# Altium schematic sheet Sheet1.SchDoc
size A4
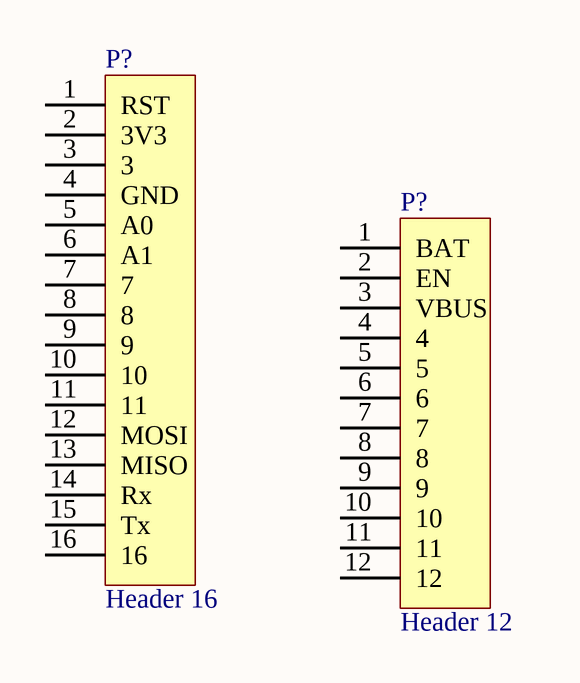
[diagram p0: Sheet1.SchDoc]

## Parts
(Parts that share a designator on the sheet are numbered #1, #2 ... from top to bottom, then left to right.)
P?#1  Header 16  [HDR1X16]
P?#2  Header 12  [HDR1X12]

## Nets

Not connected (* = marked no-connect by the designer): P?#1 1(RST) 2(3V3) 3 4(GND) 5(A0) 6(A1) 7 8 9 10 11 12(MOSI) 13(MISO) 14(Rx) 15(Tx) 16; P?#2 1(BAT) 2(EN) 3(VBUS) 4 5 6 7 8 9 10 11 12

## Library data of the parts
P?#1 = Header 16: Header, 16-Pin; LatestRevisionDate: 17-Jul-2002; LatestRevisionNote: Re-released for DXP Platform.; Publisher: Altium Limited
P?#2 = Header 12: Header, 12-Pin; LatestRevisionDate: 17-Jul-2002; LatestRevisionNote: Re-released for DXP Platform.; Publisher: Altium Limited